# EAGLE design batteryholder2S3P_revC (EAGLE 9.5.1)

## Sheet 1 of 2
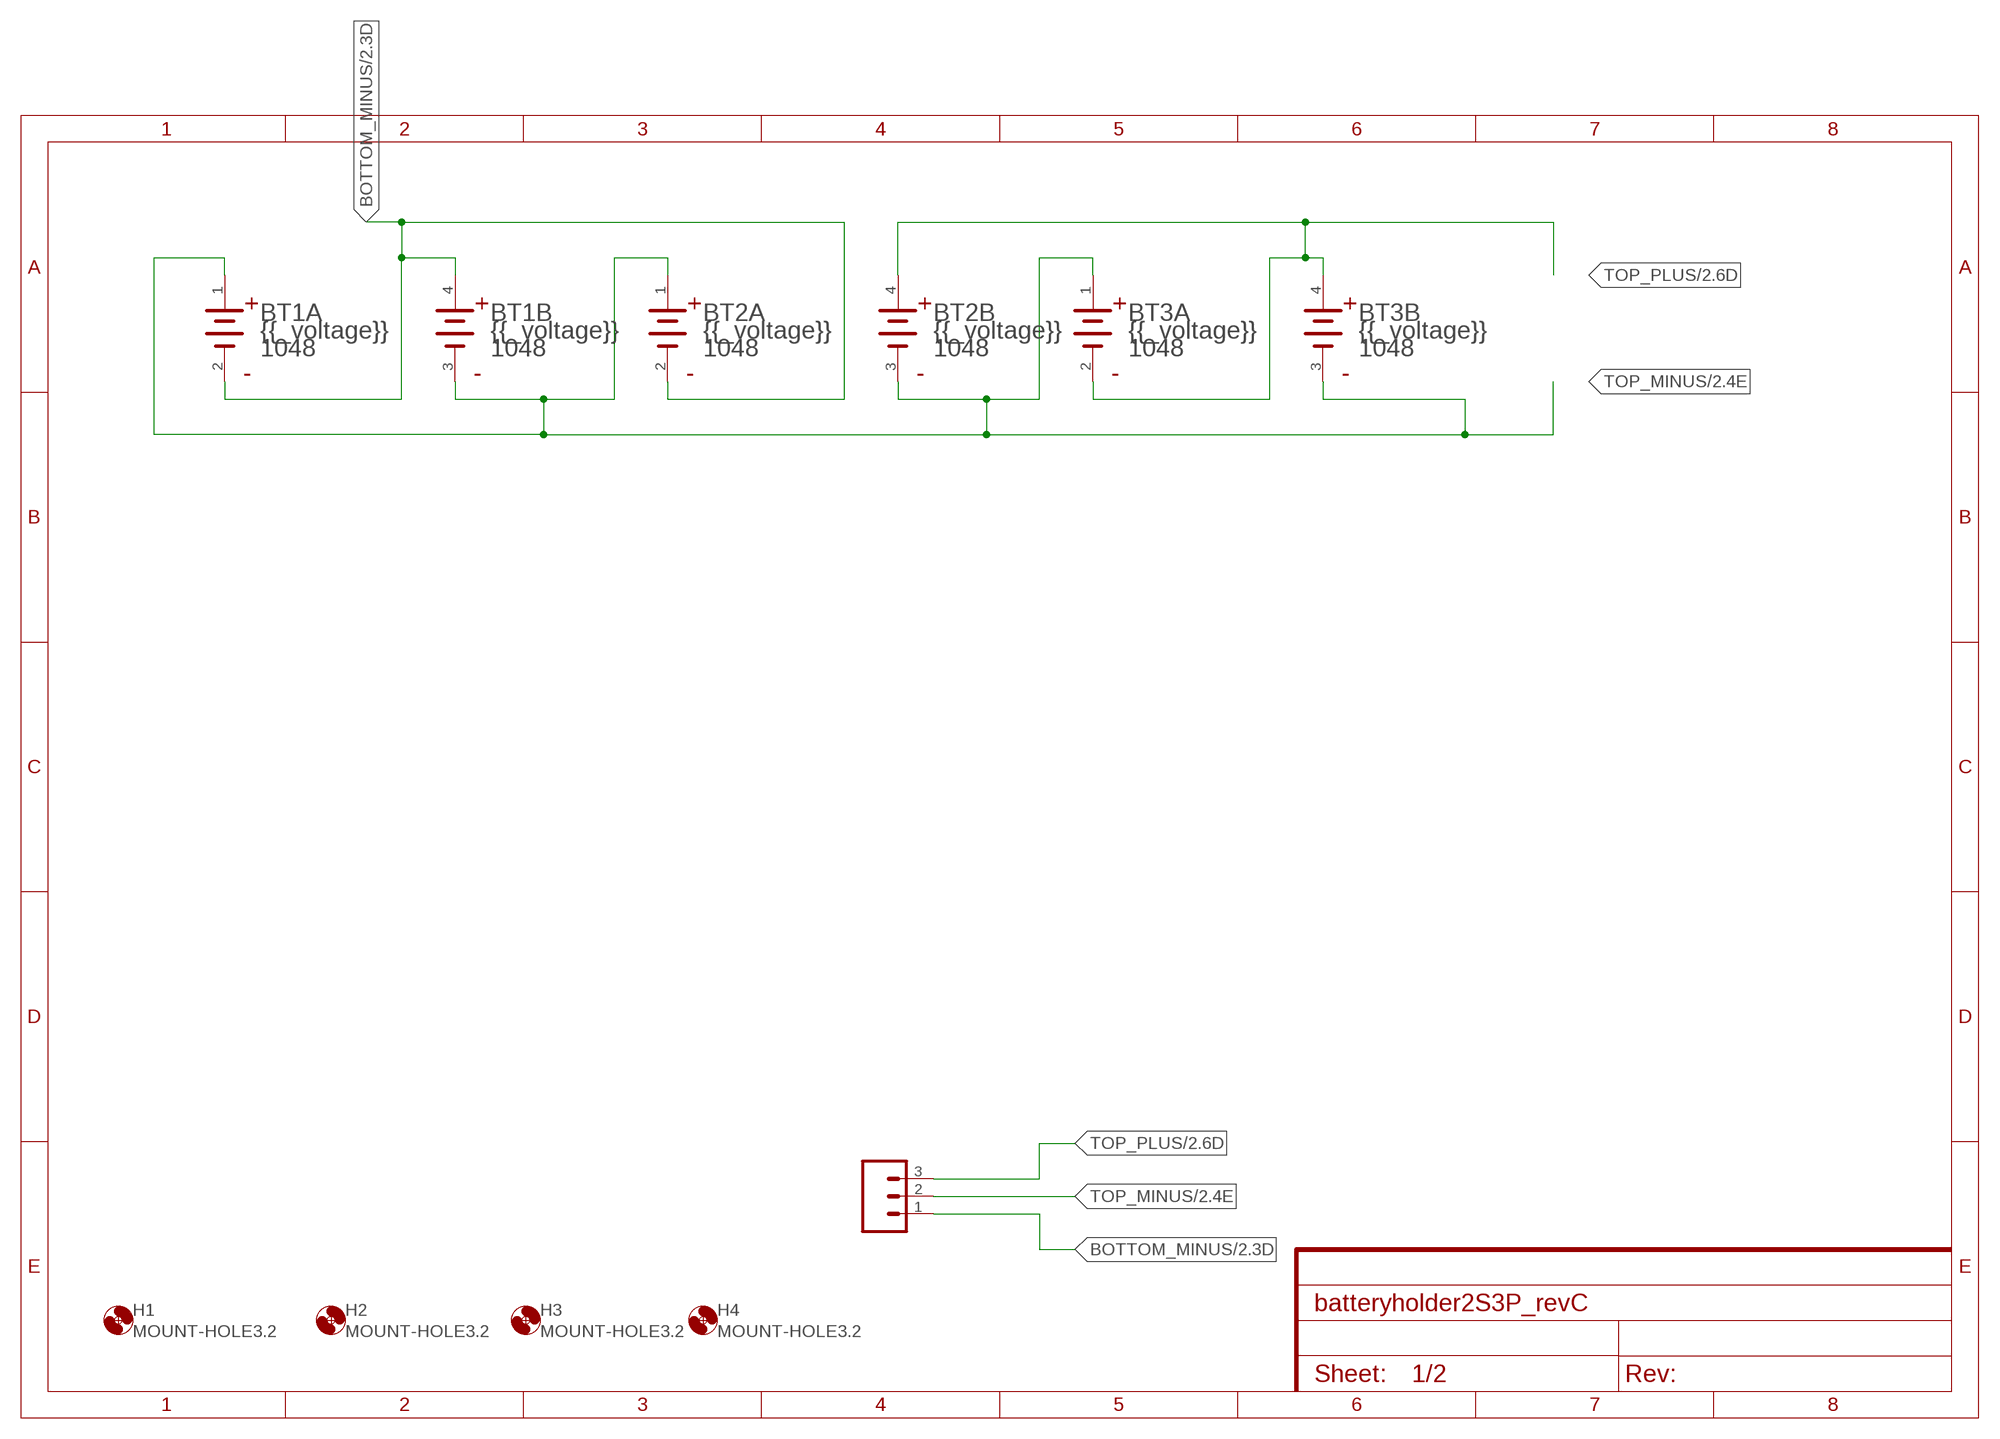
[diagram p0: schematic, sheet 1]

### Parts
BT1  KEYSTONE_1048KEYSTONE_1048_0_0  [KEYSTONE_1048_0]
BT2  KEYSTONE_1048KEYSTONE_1048_0_0  [KEYSTONE_1048_0]
BT3  KEYSTONE_1048KEYSTONE_1048_0_0  [KEYSTONE_1048_0]
H1  MOUNT-HOLE3.2  [3,2]
H2  MOUNT-HOLE3.2  [3,2]
H3  MOUNT-HOLE3.2  [3,2]
H4  MOUNT-HOLE3.2  [3,2]
J1  CONN_03-SCREW-5MM  [SCREWTERMINAL-5MM-3]

### Nets
BOTTOM_MINUS: BT1.2(A:1_CATHODE) BT1.4(B:2_ANODE) BT2.2(A:1_CATHODE) J1.1 ; also sheet 2
TOP_MINUS: BT1.1(A:1_ANODE) BT1.3(B:2_CATHODE) BT2.1(A:1_ANODE) BT2.3(B:2_CATHODE) BT3.1(A:1_ANODE) BT3.3(B:2_CATHODE) J1.2 ; also sheet 2
TOP_PLUS: BT2.4(B:2_ANODE) BT3.2(A:1_CATHODE) BT3.4(B:2_ANODE) J1.3 ; also sheet 2

## Sheet 2 of 2
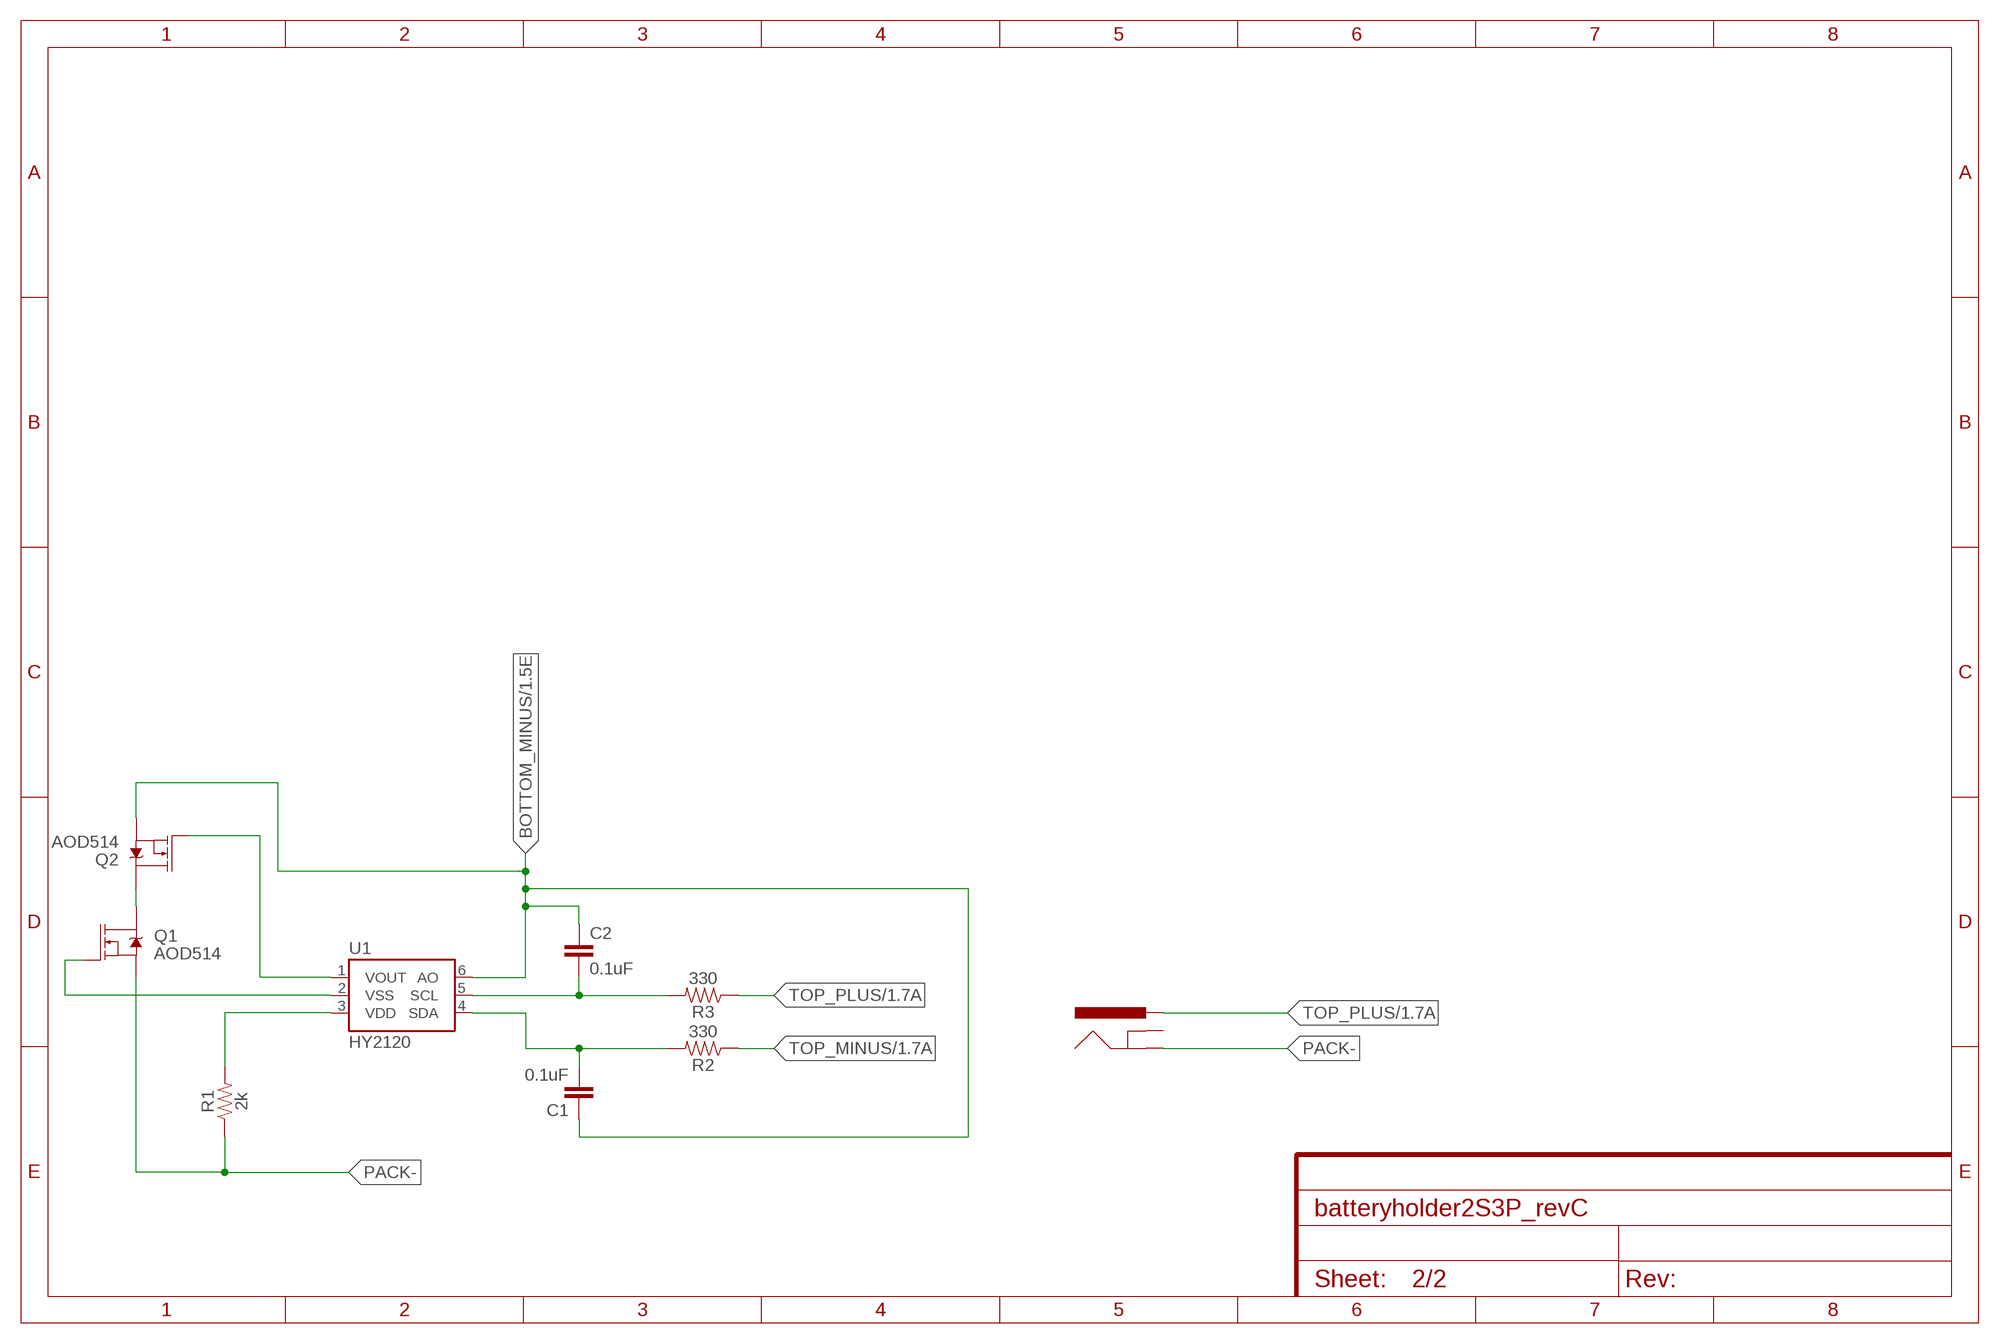
[diagram p1: schematic, sheet 2]

### Parts
C1  0.1uF  1.0UF-1206-50V-10%  [1206]
C2  0.1uF  1.0UF-1206-50V-10%  [1206]
J2  POWER_JACKPTH_BREAD  [POWER_JACK_PTH_BREAD]
Q1  AOD514  MOSFET-NCH-FDD8780  [DPAK]
Q2  AOD514  MOSFET-NCH-FDD8780  [DPAK]
R1  2k  RESISTOR1206  [1206]
R2  330  RESISTOR1206  [1206]
R3  330  RESISTOR1206  [1206]
U1  HY2120  MCP4725SOT-23  [SOT23-6]

### Nets
BOTTOM_MINUS: C1.1 C2.1 Q2.3(S) U1.6(AO) ; also sheet 1
N$1: Q2.1(G) U1.1(VOUT)
N$2: Q1.1(G) U1.2(VSS)
N$3: R1.2 U1.3(VDD)
N$4: C2.2 R3.2 U1.5(SCL)
N$5: C1.2 R2.2 U1.4(SDA)
N$6: Q1.4(D) Q2.4(D)
PACK- [power]: J2.GND Q1.3(S) R1.1
TOP_MINUS: R2.1 ; also sheet 1
TOP_PLUS: J2.PWR R3.1 ; also sheet 1
Unconnected: J2.GNDBREAK

## Library data of the parts
BT1-BT3 = Keystone - 1048:KEYSTONE_1048: SMT Holder for Dual 18650 Batteries; CENTROID_NOT_SPECIFIED: No; CONN_ORIENTATION: Horizontal; CONTACT_MATERIAL: Gold,Nickel; DATASHEET: https://www.keyelco.com/userAssets/file/M65p27.pdf; DEVICE_CLASS_L1: Connectors; DEVICE_CLASS_L2: unset; DEVICE_CLASS_L3: unset; DIGIKEY_DESCRIPTION: BATT HOLDER 18650 2 CELL SMD TAB; DIGIKEY_PART_NUMBER: 36-1048-ND; FOOTPRINT_URL: https://www.keyelco.com/product-pdf.cfm?p=920; HEIGHT: 0.595inch; LEAD_FREE: yes; MF: Keystone; MFG_PACKAGE_IDENT: 1048; MFG_PACKAGE_IDENT_DATE: 0; MFG_PACKAGE_IDENT_REV: 0; MOUSER_DESCRIPTION: Battery holder SMD Dimensions L x W x H: 86 x 39.78 x 14.86 mm Suitable for: 2 x 18650; MOUSER_PART_NUMBER: 534-1048; MPN: 1048; NUMBER_OF_CONTACTS: 2; PACKAGE: SMT_BTTHLDR_18650_DUAL; PREFIX: BT; ROHS: yes; TEMPERATURE_RANGE_HIGH: +145°C; TEMPERATURE_RANGE_LOW: -50°C; VERIFICATION_VERSION: 0.0.0.1
C1 C2 = SparkFun-Capacitors:1.0UF: 1µF ceramic capacitors A capacitor is a passive two-terminal electrical component used to store electrical energy temporarily in an electric field.; PROD_ID: CAP-09822; VALUE: 1.0uF
H1-H4 = holes:MOUNT-HOLE: MOUNTING HOLE with drill center marker
J1 = SparkFun-Connectors:CONN_03: Multi connection point. Often used as Generic Header-pin footprint for 0.1 inch spaced/style header connections On any of the 0.1 inch spaced packages, you can populate with these: Break Away Headers - Straight <https://www.sparkfun.com/products/116> (PRT-00116) Break Away Male Headers - Right Angle <https://www.sparkfun.com/products/553> (PRT-00553) Female Headers <https://www.sparkfun.com/products/115> (PRT-00115) Break Away Headers - Machine Pin <https://www.sparkfun.com/products/117> (PRT-00117) Break Away Female Headers - Swiss Machine Pin <https://www.sparkfun.com/products/743> (PRT-00743) Stackable Header - 3 Pin (Female, 0.1") <https://www.sparkfun.com/products/13875> (PRT-13875) For SCREWTERMINALS and SPRING TERMINALS visit here: Screw Terimnals on SparkFun.com <https://www.sparkfun.com/search/results?term=Screw+Terminals> (5mm/3.5mm/2.54mm spacing) This device is also useful as a general connection point to wire up your design to another part of your project. Our various solder wires solder well into these plated through hole pads. Hook-Up Wire - Assortment (Stranded, 22 AWG) <https://www.sparkfun.com/products/11375> (PRT-11375) Hook-Up Wire - Assortment (Solid Core, 22 AWG) <https://www.sparkfun.com/products/11367> (PRT-11367) View the entire wire category on our website here <https://www.sparkfun.com/categories/141> Special notes: Molex polarized connector foot print use with SKU : PRT-08232 with associated crimp pins and housings.; PROD_ID: CONN-10134; SF_SKU: PRT-08433
J2 = SparkFun-Connectors:POWER_JACK: Power Jack Connector This is the standard 5.5mm barrel jack for power. The PTH is the most common, proven, reliable, footprint. The Slot footprint only works if the mill layer is transmitted to the PCB fab house so be warned. Here are the connectors we sell at SparkFun: DC Barrel Power Jack/Connector <https://www.sparkfun.com/products/119> (PRT-00119) DC Barrel Power Jack/Connector (SMD) <https://www.sparkfun.com/products/12748> (PRT-12748) DC Barrel Jack Adapter - Breadboard Compatible <https://www.sparkfun.com/products/10811> (PRT-10811) It is used on this SparkFun product (and many, many others): SparkFun RedBoard - Programmed with Arduino <https://www.sparkfun.com/products/12757> (DEV-12757) Also, if you need a mating power supply or connector, please check these out: Wall Adapter Power Supply - 9VDC 650mA <https://www.sparkfun.com/products/298> (TOL-00298) DC Barrel Jack Adapter - Male <https://www.sparkfun.com/products/10287> (PRT-10287); PROD_ID: PRT-10811
Q1 Q2 = SparkFun-DiscreteSemi:MOSFET-NCH: N-channel MOSFETs Voltage controlled devices that allow control of high current outputs. SparkFun Products: SparkFun OpenScale <https://www.sparkfun.com/products/13261> SparkFun Digital Sandbox <https://www.sparkfun.com/products/12651> SparkFun Monster Moto Shield <https://www.sparkfun.com/products/10182> SparkFun MOSFET Power Controller <https://www.sparkfun.com/products/11214>; PROD_ID: TRANS-09984; VALUE: 35A/25V/8.5mΩ
R1-R3 = SparkFun-Resistors:RESISTOR: Generic Resistor Package
U1 = SparkFun-IC-Conversion:MCP4725: MCP4725 DAC Microchip 12-bit I2C DAC, SOT23-6 Datasheet <https://cdn.sparkfun.com/datasheets/BreakoutBoards/MCP4725_2009.pdf> SparkFun Products SparkFun I2C DAC Breakout - MCP4725 <https://www.sparkfun.com/products/12918> (BOB-12918); PROD_ID: IC-08886; VALUE: MCP4725

## Net classes
1 power: clearance 0.762 mm

## Board
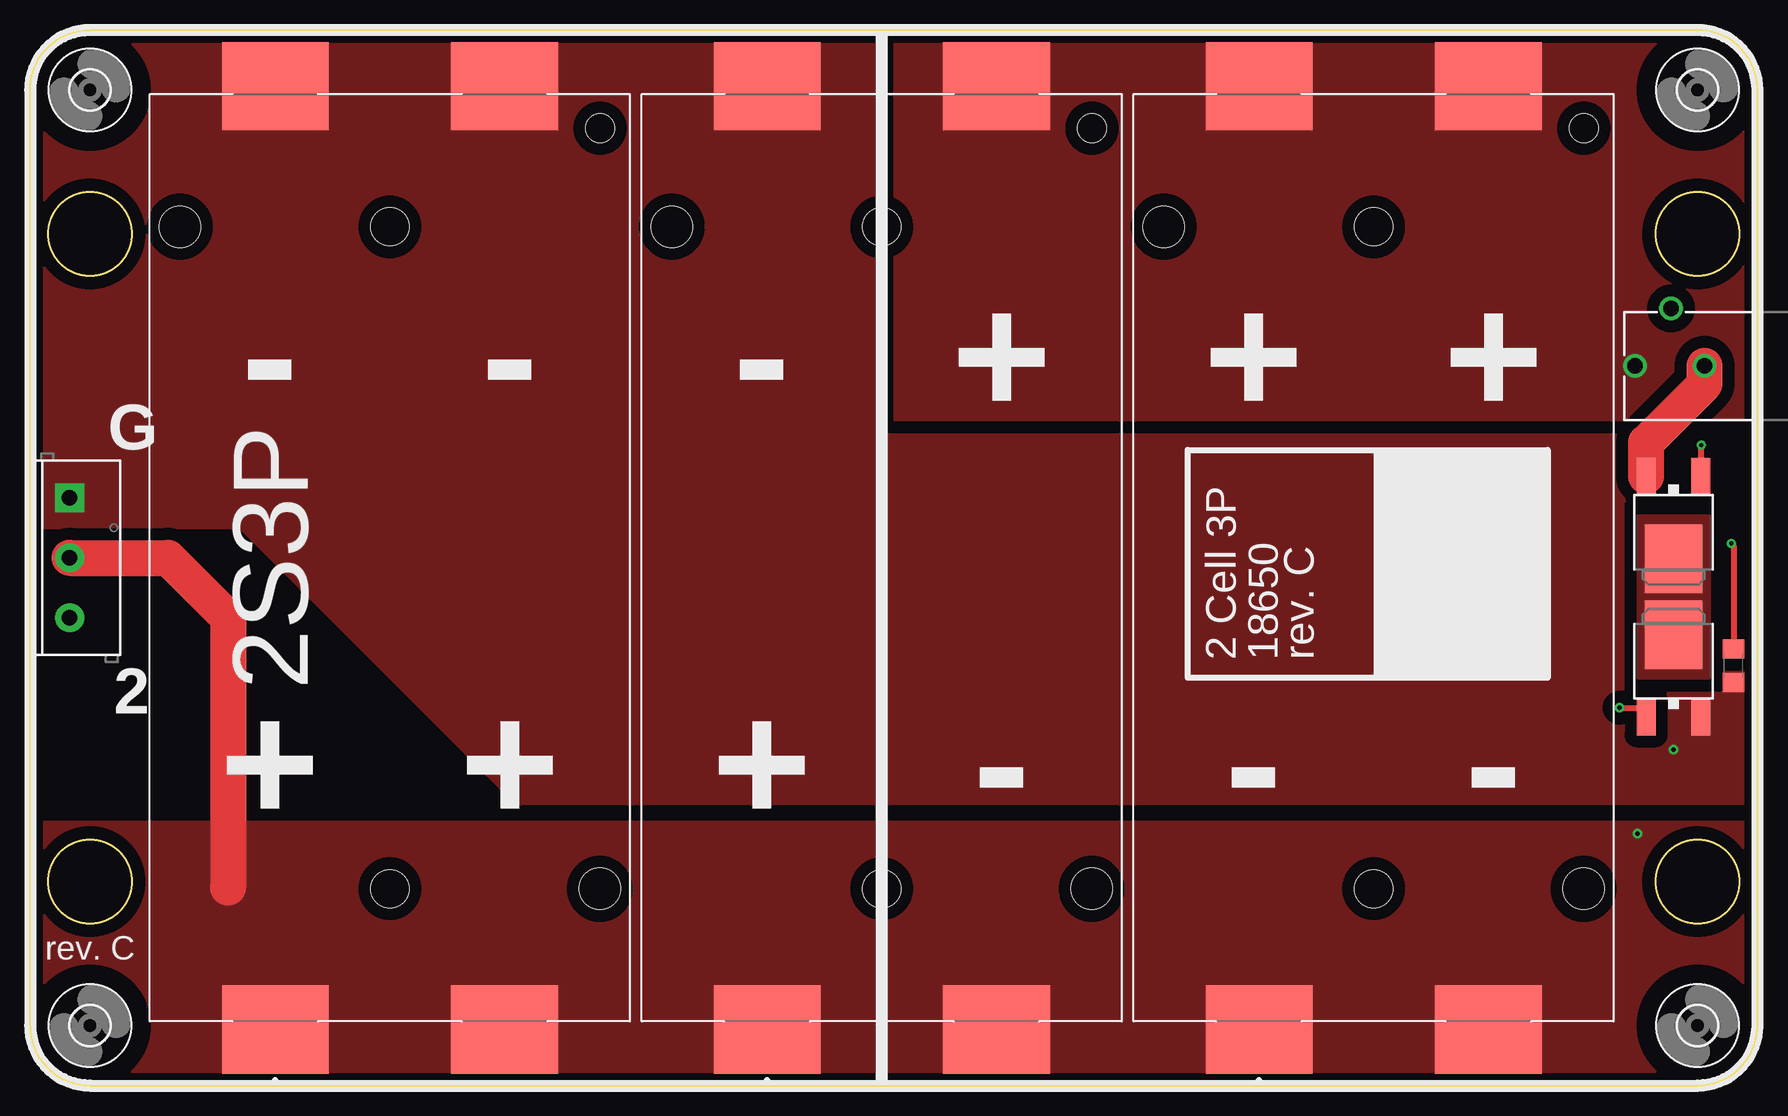
[diagram p2: board, top side]
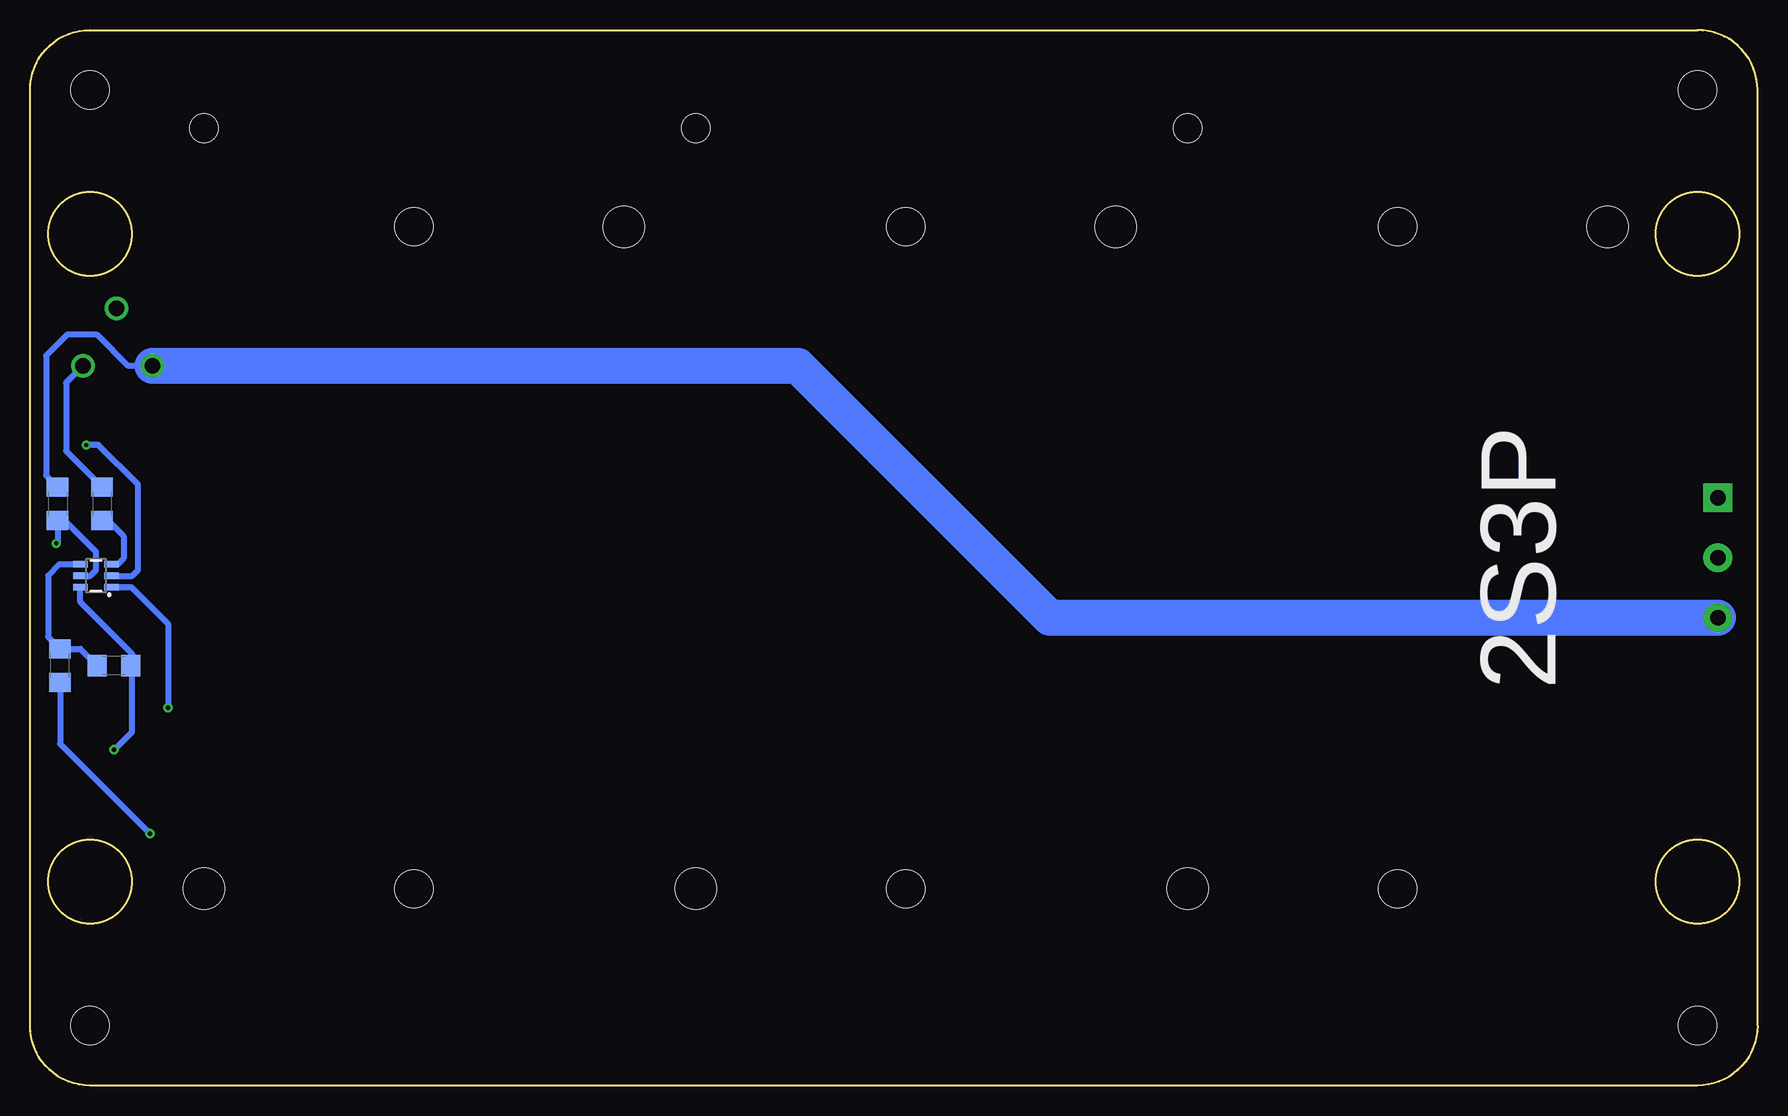
[diagram p3: board, bottom side, seen from below]

Size 144 x 88 mm. Coordinates in mm from the lower left corner, seen from the top.
Outline: 0,76 0,83 arc-90 5,88 139,88 arc-90 144,83 144,5 arc-90 139,0 5,0 arc-90 0,5 0,76.1
Outline: circle at 5,17 radius 3.5
Outline: circle at 5,71 radius 3.5
Outline: circle at 139,71 radius 3.5
Outline: circle at 139,17 radius 3.5
Copper layers (1*16): Top 0.035mm / dielectric 1.5mm / Bottom 0.035mm
Design rules "default": minimum track width 6mil, minimum drill 0.35mm, track to track 6mil, track to pad 6mil, pad to pad 6mil, via to via 6mil, smd to smd 6mil, copper to edge 40mil, drill to drill 6mil, minimum pad ring 10mil, minimum via ring 8mil, stop-mask expansion 4mil, vias tented up to drill 0mil, thermal gap 10mil

### Footprints (pad centres in the part's own frame; a part is rotated, then mirrored left to right if it is on the bottom)
KEYSTONE_1048_0 = smd 7.34 x 8.89: 1 -39.33,9.555; 2 39.33,9.555; 3 -39.33,-9.555; 4 39.33,-9.555 | hole 3.45: 27.6,17.505; -27.6,-17.505 | hole 2.39: 35.82,-17.505 | hole 3.17: 27.6,0; -27.6,0
1206 = smd 1.6 x 1.8: 1 -1.4,0; 2 1.4,0
3,2 = hole 3.2: 0,0
SCREWTERMINAL-5MM-3 = drill 1.3 pad 2.413 square: 1 0,0 | drill 1.3 pad 2.413: 2 5,0; 3 10,0
POWER_JACK_PTH_BREAD = drill 1.3: GND 0,7.9; GNDBREAK 4.8,10.7; PWR 0,13.7
DPAK = smd 1.6 x 3: 1 -2.28,-5.31; 3 2.28,-5.31 | smd 4.826 x 5.715: 4 0,1.588
SOT23-6 = smd 0.55 x 1.2: 1 0.95,1.3; 2 0,1.3; 3 -0.95,1.3; 4 -0.95,-1.3; 5 0,-1.3; 6 0.95,-1.3

### Placement (x,y rotation side)
BT1  30,44 90 top
BT2  71,44 90 top
BT3  112,44 90 top
C1  137,35 180 bottom
C2  142,35 90 top
H1  5,83 0 top
H2  5,5 0 top
H3  139,83 0 top
H4  139,5 0 top
J1  3.3,49 270 top
J2  147.5,60 90 top
Q1  137,45.5 180 top
Q2  137,36 0 top
R1  138,48.5 270 bottom
R2  141.5,35 90 bottom
R3  141.7,48.5 270 bottom
U1  138.5,42.5 270 bottom

### Tracks (layer width: path | path; a pad name or v marks a point on that pad's centre or on a via)
BOTTOM_MINUS  (via drill 0.35)
  Top 3: 20.5,83.28 BT1.2
  Bottom 0.5: U1.6 139.8,40.3 135.5,36 135.5,35.1 | C1.1 135.5,35.1 | v137,28 135.5,29.5 135.5,35.1
  pour Top (isolate 1, rank 2, no thermals): 144,46.5 0,46.5 0,88 144,88
  pour Top (isolate 1, rank 2, no thermals): 144,23.5 40.5,23.5 16,48 16,54 143.5,54 144,53.5
N$1  (via drill 0.35)
  Top 0.5: v132.5,31.5 134.72,31.5 Q2.1
  Bottom 0.5: v132.5,31.5 132.5,38.5 135.55,41.55 U1.1
N$2  (via drill 0.35)
  Top 0.5: v139.3,53.4 139.28,53.38 Q1.1
  Bottom 0.5: U1.2 135.5,42.5 135,43 135,50.1 138.3,53.4 v139.3,53.4
N$3
  Bottom 0.5: U1.3 136.7,43.45 136.2,43.95 136.2,45.8 137.5,47.1 R1.2
N$4  (via drill 0.35)
  Top 0.5: v141.8,45.2 142,45 C2.2
  Bottom 0.5: U1.5 139,42.5 138.5,43 138.5,44.5 141.1,47.1 R3.2 141.7,45.3 v141.8,45.2
N$5
  Bottom 0.5: U1.4 141.55,43.45 142.5,42.5 142.5,37.4 R2.2 139.8,36.4 C1.2
N$6
  pour Top (no thermals): 140,47.5 134,47.5 134,34 140,34
PACK-
  Top 3: Q1.3 134.72,53.62 139.6,58.5 J2.GND
  Bottom 0.5: R1.1 141,52.9 141,58.6 J2.GND
TOP_MINUS  (via drill 0.35)
  Top 3: J1.2 11.5,44 16.5,39 16.5,16.5
  Bottom 0.5: R2.1 141.5,28.5 v134,21
  pour Top (isolate 1, no thermals): 0,0 0,22 144,22 144,0
TOP_PLUS
  Bottom 0.5: J2.PWR 135.8,60 138.4,62.6 140.9,62.6 142.66,60.84 142.66,50.86 R3.1
  Bottom 3: J1.3 59,39 80,60 J2.PWR
  pour Top (isolate 1, no thermals): 72,88 72,55.5 144,55.5 144,88

### Text on the board
tPlace: - | - | - | + | + | + | G | 2S3P | 2 Cell 3P | 18650 | rev. C | 2 | + | + | + | - | - | - | rev. C
bPlace: 2S3P